# Altium schematic sheet COMM.SchDoc
size A4
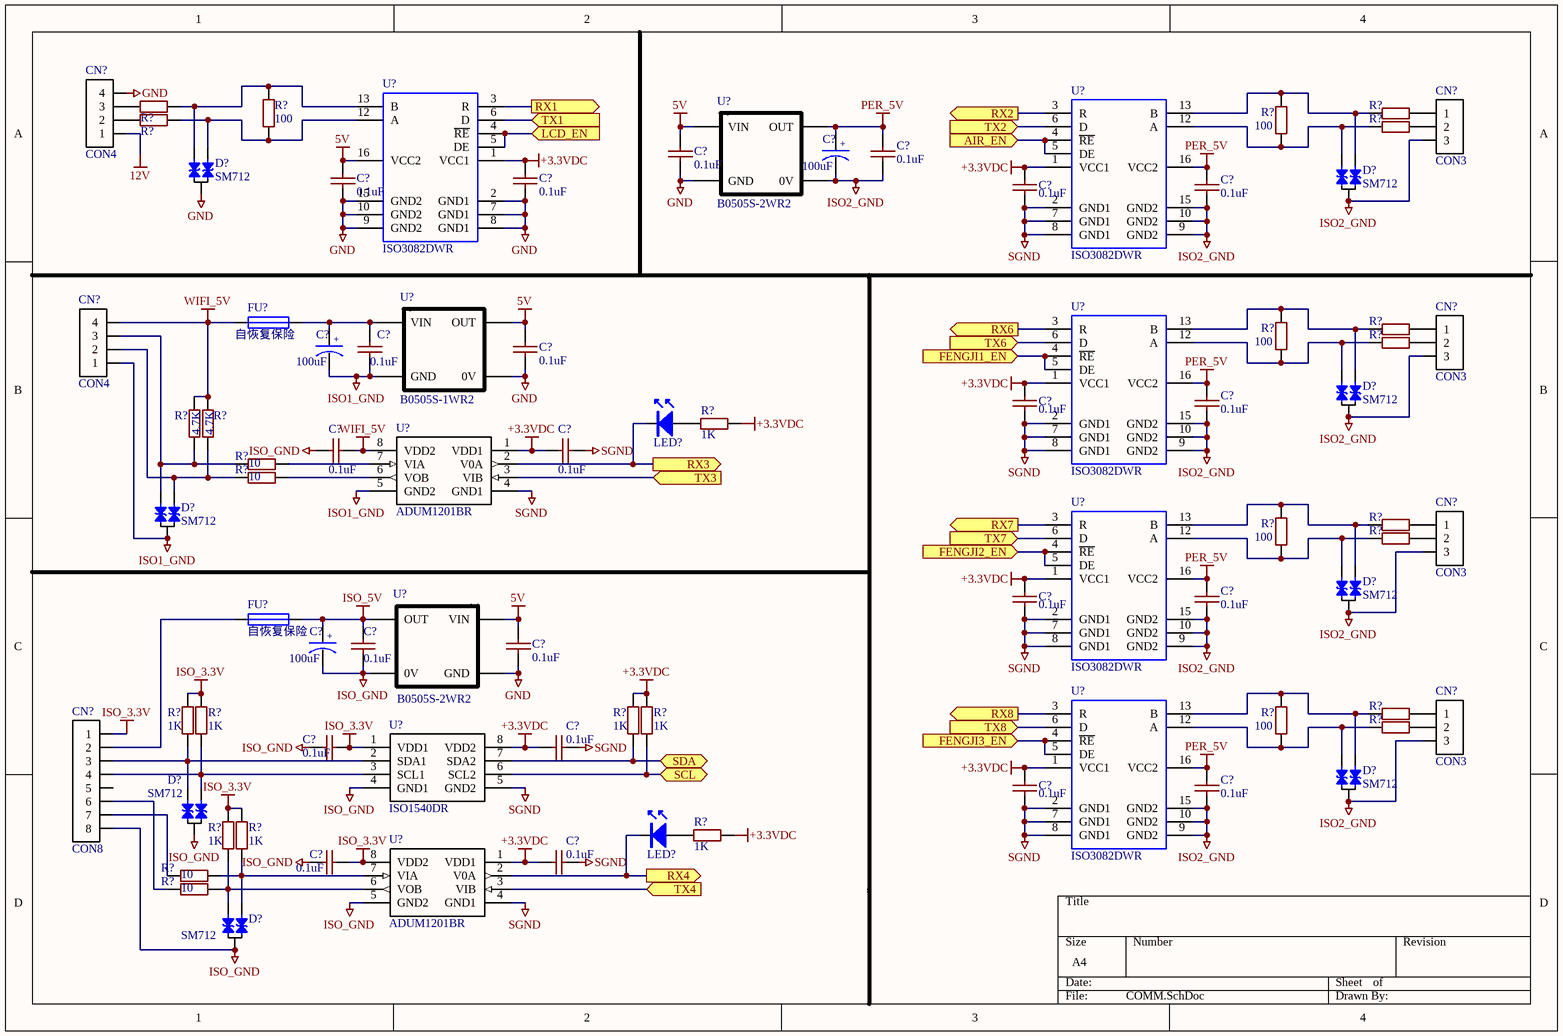
[diagram p0: COMM.SchDoc]

## Parts
(Parts that share a designator on the sheet are numbered #1, #2 ... from top to bottom, then left to right.)
C?#1  100uF  [HONOR_63X54]
C?#2  0.1uF  [0603_C]
C?#3  0.1uF  [0603_C]
C?#4  0.1uF  [0603_C]
C?#5  0.1uF  [0603_C]
C?#6  0.1uF  [0603_C]
C?#7  0.1uF  [0603_C]
C?#8  100uF  [HONOR_63X54]
C?#9  0.1uF  [0603_C]
C?#10  0.1uF  [0603_C]
C?#11  0.1uF  [0603_C]
C?#12  0.1uF  [0603_C]
C?#13  0.1uF  [0603_C]
C?#14  0.1uF  [0603_C]
C?#15  0.1uF  [0603_C]
C?#16  0.1uF  [0603_C]
C?#17  100uF  [HONOR_63X54]
C?#18  0.1uF  [0603_C]
C?#19  0.1uF  [0603_C]
C?#20  0.1uF  [0603_C]
C?#21  0.1uF  [0603_C]
C?#22  0.1uF  [0603_C]
C?#23  0.1uF  [0603_C]
C?#24  0.1uF  [0603_C]
C?#25  0.1uF  [0603_C]
CN?#1  CON3  [HB9500-3P]
CN?#2  CON4
CN?#3  CON3  [HB9500-3P]
CN?#4  CON4
CN?#5  CON3  [HB9500-3P]
CN?#6  CON3  [HB9500-3P]
CN?#7  CON8
D?#1  SM712  [SOT-23]
D?#2  SM712  [SOT-23]
D?#3  SM712  [SOT-23]
D?#4  SM712  [SOT-23]
D?#5  SM712  [SOT-23]
D?#6  SM712  [SOT-23]
D?#7  SM712  [SOT-23]
D?#8  SM712  [SOT-23]
FU?#1  自恢复保险  [BX]
FU?#2  自恢复保险  [BX]
LED?#1  Led  [0603_LED]  (value not drawn)
LED?#2  Led  [0603_LED]  (value not drawn)
R?#1  RES  [0603_R]  (value not drawn)
R?#2  100  [0603_R]
R?#3  RES  [0603_R]  (value not drawn)
R?#4  RES  [0603_R]  (value not drawn)
R?#5  100  [0603_R]
R?#6  RES  [0603_R]  (value not drawn)
R?#7  RES  [0603_R]  (value not drawn)
R?#8  100  [0603_R]
R?#9  RES  [0603_R]  (value not drawn)
R?#10  4.7K  [1206_R]
R?#11  4.7K  [1206_R]
R?#12  1K  [1206_R]
R?#13  10  [0603_R]
R?#14  10  [0603_R]
R?#15  RES  [0603_R]  (value not drawn)
R?#16  100  [0603_R]
R?#17  RES  [0603_R]  (value not drawn)
R?#18  RES  [0603_R]  (value not drawn)
R?#19  1K  [1206_R]
R?#20  1K  [1206_R]
R?#21  1K  [1206_R]
R?#22  1K  [1206_R]
R?#23  100  [0603_R]
R?#24  RES  [0603_R]  (value not drawn)
R?#25  1K  [1206_R]
R?#26  1K  [1206_R]
R?#27  1K  [1206_R]
R?#28  10  [0603_R]
R?#29  10  [0603_R]
U?#1  ISO3082DWR  [SOIC_16]
U?#2  ISO3082DWR  [SOIC_16]
U?#3  B0505S-2WR2  [DCDC-BS2W]
U?#4  B0505S-1WR2  [B0505S_1W]
U?#5  ISO3082DWR  [SOIC_16]
U?#6  ADUM1201BR  [SOIC127P600X175-8M]
U?#7  ISO3082DWR  [SOIC_16]
U?#8  B0505S-2WR2  [DCDC-BS2W]
U?#9  ISO3082DWR  [SOIC_16]
U?#10  ISO1540DR  [SO8]
U?#11  ADUM1201BR  [SOIC127P600X175-8M]

## Ports
AIR_EN (in), FENGJI1_EN (in), FENGJI2_EN (in), FENGJI3_EN (in), LCD_EN (in), RX1 (out), RX2 (out), RX3 (out), RX4 (out), RX6 (out), RX7 (out), RX8 (out), SCL, SDA, TX1 (in), TX2 (in), TX3 (in), TX4 (in), TX6 (in), TX7 (in), TX8 (in)

## Nets
5V: C?#2.2 C?#4.2 C?#10.2 C?#19.2 U?#1.16(VCC2) U?#3.1(VIN) U?#4.4(OUT) U?#8.1(VIN)
12V: CN?#2.1
+3.3VDC: C?#5.2 C?#6.2 C?#11.2 C?#14.2 C?#15.2 C?#21.2 C?#22.2 C?#25.2 R?#12.2 R?#21.2 R?#22.2 R?#27.2 U?#1.1(VCC1) U?#2.1(VCC1) U?#5.1(VCC1) U?#6.1(VDD1) U?#7.1(VCC1) U?#9.1(VCC1) U?#10.8(VDD2) U?#11.1(VDD1)
GND: C?#2.1 C?#4.1 C?#5.1 C?#10.1 C?#19.1 CN?#2.4 D?#1.3 U?#1.2(GND1) U?#1.7(GND1) U?#1.8(GND1) U?#1.9(GND2) U?#1.10(GND2) U?#1.15(GND2) U?#3.2(GND) U?#4.3(0V) U?#8.2(GND)
ISO1_GND: C?#8.2 C?#9.1 CN?#4.1 D?#4.3 U?#4.1(GND) U?#6.5(GND2)
ISO2_GND: C?#1.2 C?#3.1 C?#7.1 C?#12.1 C?#16.1 C?#23.1 CN?#1.3 CN?#3.3 CN?#5.3 CN?#6.3 D?#2.3 D?#3.3 D?#5.3 D?#6.3 U?#2.9(GND2) U?#2.10(GND2) U?#2.15(GND2) U?#3.4(0V) U?#5.9(GND2) U?#5.10(GND2) U?#5.15(GND2) U?#7.9(GND2) U?#7.10(GND2) U?#7.15(GND2) U?#9.9(GND2) U?#9.10(GND2) U?#9.15(GND2)
ISO_3.3V: C?#20.1 C?#24.1 CN?#7.1 R?#19.2 R?#20.2 R?#25.2 R?#26.2 U?#10.1(VDD1) U?#11.8(VDD2)
ISO_5V: C?#17.1 C?#18.2 FU?#2.1 U?#8.6(OUT)
ISO_GND: C?#13.2 C?#17.2 C?#18.1 C?#20.2 C?#24.2 CN?#7.8 D?#7.3 D?#8.3 U?#8.4(0V) U?#10.4(GND1) U?#11.5(GND2)
PER_5V: C?#1.1 C?#3.2 C?#7.2 C?#12.2 C?#16.2 C?#23.2 U?#2.16(VCC2) U?#3.6(OUT) U?#5.16(VCC2) U?#7.16(VCC2) U?#9.16(VCC2)
SGND: C?#6.1 C?#11.1 C?#14.1 C?#15.1 C?#21.1 C?#22.1 C?#25.1 U?#2.2(GND1) U?#2.7(GND1) U?#2.8(GND1) U?#5.2(GND1) U?#5.7(GND1) U?#5.8(GND1) U?#6.4(GND1) U?#7.2(GND1) U?#7.7(GND1) U?#7.8(GND1) U?#9.2(GND1) U?#9.7(GND1) U?#9.8(GND1) U?#10.5(GND2) U?#11.4(GND1)
WIFI_5V: C?#13.1 CN?#4.4 FU?#1.2 R?#10.2 R?#11.2 U?#6.8(VDD2)
AIR_EN: U?#2.4(~{RE}) U?#2.5(DE) ; port AIR_EN
FENGJI1_EN: U?#5.4(~{RE}) U?#5.5(DE) ; port FENGJI1_EN
FENGJI2_EN: U?#7.4(~{RE}) U?#7.5(DE) ; port FENGJI2_EN
FENGJI3_EN: U?#9.4(~{RE}) U?#9.5(DE) ; port FENGJI3_EN
LCD_EN: U?#1.4(~{RE}) U?#1.5(DE) ; port LCD_EN
RX1: U?#1.3(R) ; port RX1
RX2: U?#2.3(R) ; port RX2
RX3: LED?#1.K U?#6.2(V0A) ; port RX3
RX4: LED?#2.K U?#11.2(V0A) ; port RX4
RX6: U?#5.3(R) ; port RX6
RX7: U?#7.3(R) ; port RX7
RX8: U?#9.3(R) ; port RX8
SCL: R?#22.1 U?#10.6(SCL2) ; port SCL
SDA: R?#21.1 U?#10.7(SDA2) ; port SDA
TX1: U?#1.6(D) ; port TX1
TX2: U?#2.6(D) ; port TX2
TX3: U?#6.3(VIB) ; port TX3
TX4: U?#11.3(VIB) ; port TX4
TX6: U?#5.6(D) ; port TX6
TX7: U?#7.6(D) ; port TX7
TX8: U?#9.6(D) ; port TX8
NetC?#8_1: C?#8.1 C?#9.2 FU?#1.1 U?#4.2(VIN)
NetCN?#1_1: CN?#1.1 R?#3.1
NetCN?#1_2: CN?#1.2 R?#6.1
NetCN?#2_2: CN?#2.2 R?#4.1
NetCN?#2_3: CN?#2.3 R?#1.1
NetCN?#3_1: CN?#3.1 R?#7.1
NetCN?#3_2: CN?#3.2 R?#9.1
NetCN?#4_2: CN?#4.2 D?#4.1 R?#11.1 R?#14.2
NetCN?#4_3: CN?#4.3 D?#4.2 R?#10.1 R?#13.2
NetCN?#5_1: CN?#5.1 R?#15.1
NetCN?#5_2: CN?#5.2 R?#17.1
NetCN?#6_1: CN?#6.1 R?#18.1
NetCN?#6_2: CN?#6.2 R?#24.1
NetCN?#7_2: CN?#7.2 FU?#2.2
NetCN?#7_3: CN?#7.3 D?#7.2 R?#19.1 U?#10.2(SDA1)
NetCN?#7_4: CN?#7.4 D?#7.1 R?#20.1 U?#10.3(SCL1)
NetCN?#7_6: CN?#7.6 R?#29.2
NetCN?#7_7: CN?#7.7 R?#28.2
NetD?#1_1: D?#1.1 R?#1.2 R?#2.2 U?#1.13(B)
NetD?#1_2: D?#1.2 R?#2.1 R?#4.2 U?#1.12(A)
NetD?#2_1: D?#2.1 R?#3.2 R?#5.2 U?#2.13(B)
NetD?#2_2: D?#2.2 R?#5.1 R?#6.2 U?#2.12(A)
NetD?#3_1: D?#3.1 R?#7.2 R?#8.2 U?#5.13(B)
NetD?#3_2: D?#3.2 R?#8.1 R?#9.2 U?#5.12(A)
NetD?#5_1: D?#5.1 R?#15.2 R?#16.2 U?#7.13(B)
NetD?#5_2: D?#5.2 R?#16.1 R?#17.2 U?#7.12(A)
NetD?#6_1: D?#6.1 R?#18.2 R?#23.2 U?#9.13(B)
NetD?#6_2: D?#6.2 R?#23.1 R?#24.2 U?#9.12(A)
NetD?#8_1: D?#8.1 R?#26.1 R?#28.1 U?#11.7(VIA)
NetD?#8_2: D?#8.2 R?#25.1 R?#29.1 U?#11.6(VOB)
NetLED?#1_A: LED?#1.A R?#12.1
NetLED?#2_A: LED?#2.A R?#27.1
NetR?#13_1: R?#13.1 U?#6.7(VIA)
NetR?#14_1: R?#14.1 U?#6.6(VOB)

Not connected (* = marked no-connect by the designer): CN?#7 5; U?#1 11(NC) 14(NC); U?#2 11(NC) 14(NC); U?#5 11(NC) 14(NC); U?#7 11(NC) 14(NC); U?#9 11(NC) 14(NC)

## Notes on the sheet
- (in symbol CAP  POL) +

## Library data of the parts
C?#1 C?#8 C?#17 = CAP  POL: 电解电容; 松下: EEEHAA101WAP
C?#2-C?#7 C?#9-C?#16 C?#18-C?#25 = CAP: 电容; 三星: CL10B104JB8NNNC; 风华: 0603B104J500NT
CN?#1 CN?#3 CN?#5 CN?#6 = CON3: 连接器
CN?#2 CN?#4 = CON4: 连接器
CN?#7 = CON8: 连接器
D?#1-D?#8 = TVS: 台湾元基: SM712
FU?#1 FU?#2 = FUSE1: 保险
LED?#1 LED?#2 = Led: 发光二极管
R?#1-R?#29 = RES: 电阻
U?#1 U?#2 U?#5 U?#7 U?#9 = ISO3082DWR: 485隔离芯片
U?#3 U?#8 = B1205S-2W: 12V转5V电源隔离模块
U?#4 = B0505S-1WR2: 5V转5V电源隔离模块
U?#6 U?#11 = ADUM1201BR: Quad-Channel Digital Isolators; ADI(亚德诺): ADUM1201BRZ
U?#10 = ISO1540DR: I2C隔离芯片